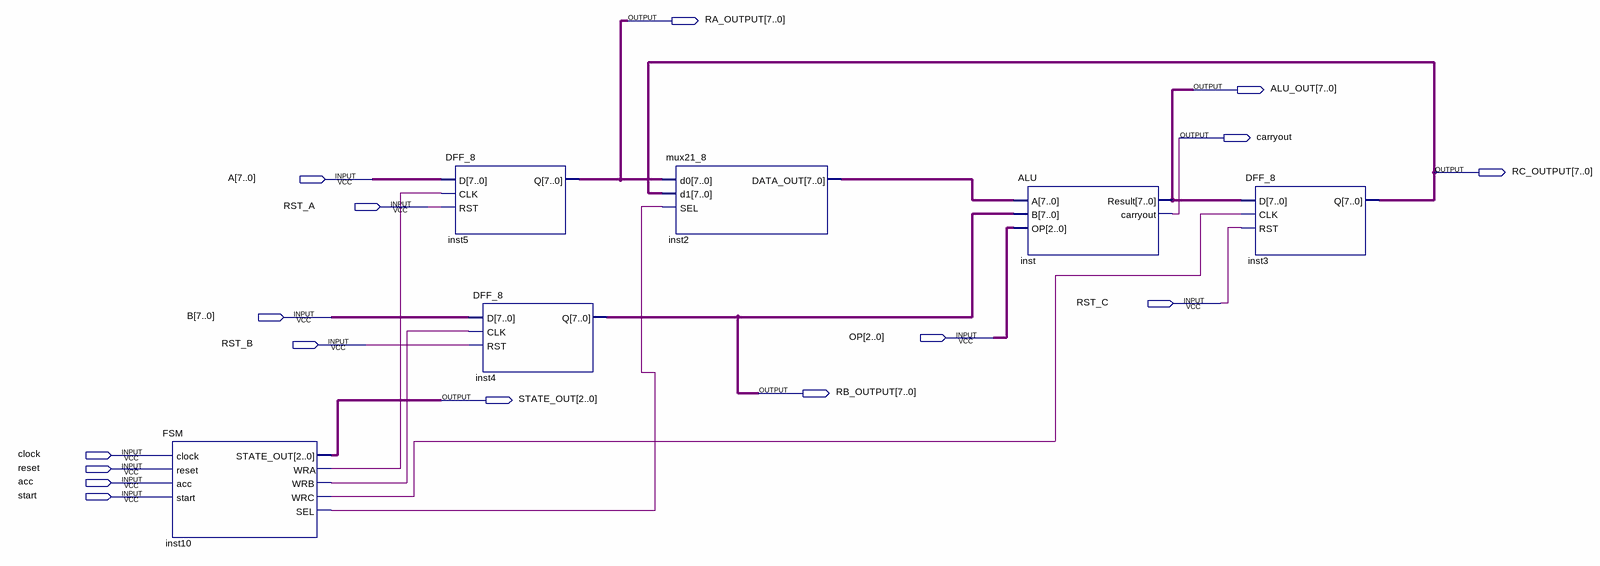
[diagram p0: schematic sheet]
// Quartus schematic alu_dataflow.bdf as structural Verilog: 6 symbols, 16 pins
module alu_dataflow (
  input  [7:0] A,
  input  RST_A,
  input  RST_C,
  input  [7:0] B,
  input  [2:0] OP,
  input  RST_B,
  input  clock,
  input  reset,
  input  acc,
  input  start,
  output [7:0] RA_OUTPUT,
  output [7:0] ALU_OUT,
  output carryout,
  output [7:0] RC_OUTPUT,
  output [7:0] RB_OUTPUT,
  output [2:0] STATE_OUT
);

  wire inst10_sel, inst10_wra, inst10_wrb, inst10_wrc;
  wire [7:0] inst2_data_out;

  FSM inst10 (
    .clock(clock), .reset(reset), .acc(acc), .start(start), .STATE_OUT(STATE_OUT), .WRA(inst10_wra),
    .WRB(inst10_wrb), .WRC(inst10_wrc), .SEL(inst10_sel));
  DFF_8 inst5 (.D(A), .CLK(inst10_wra), .RST(RST_A), .Q(RA_OUTPUT));
  DFF_8 inst4 (.D(B), .CLK(inst10_wrb), .RST(RST_B), .Q(RB_OUTPUT));
  mux21_8 inst2 (.d0(RA_OUTPUT), .d1(RC_OUTPUT), .SEL(inst10_sel), .DATA_OUT(inst2_data_out));
  ALU inst (.A(inst2_data_out), .B(RB_OUTPUT), .OP(OP), .Result(ALU_OUT), .carryout(carryout));
  DFF_8 inst3 (.D(ALU_OUT), .CLK(inst10_wrc), .RST(RST_C), .Q(RC_OUTPUT));
endmodule
